# Altium schematic sheet Sheet1.SchDoc: Volume_LED_indicator
size A3; Author: Sergiy_83
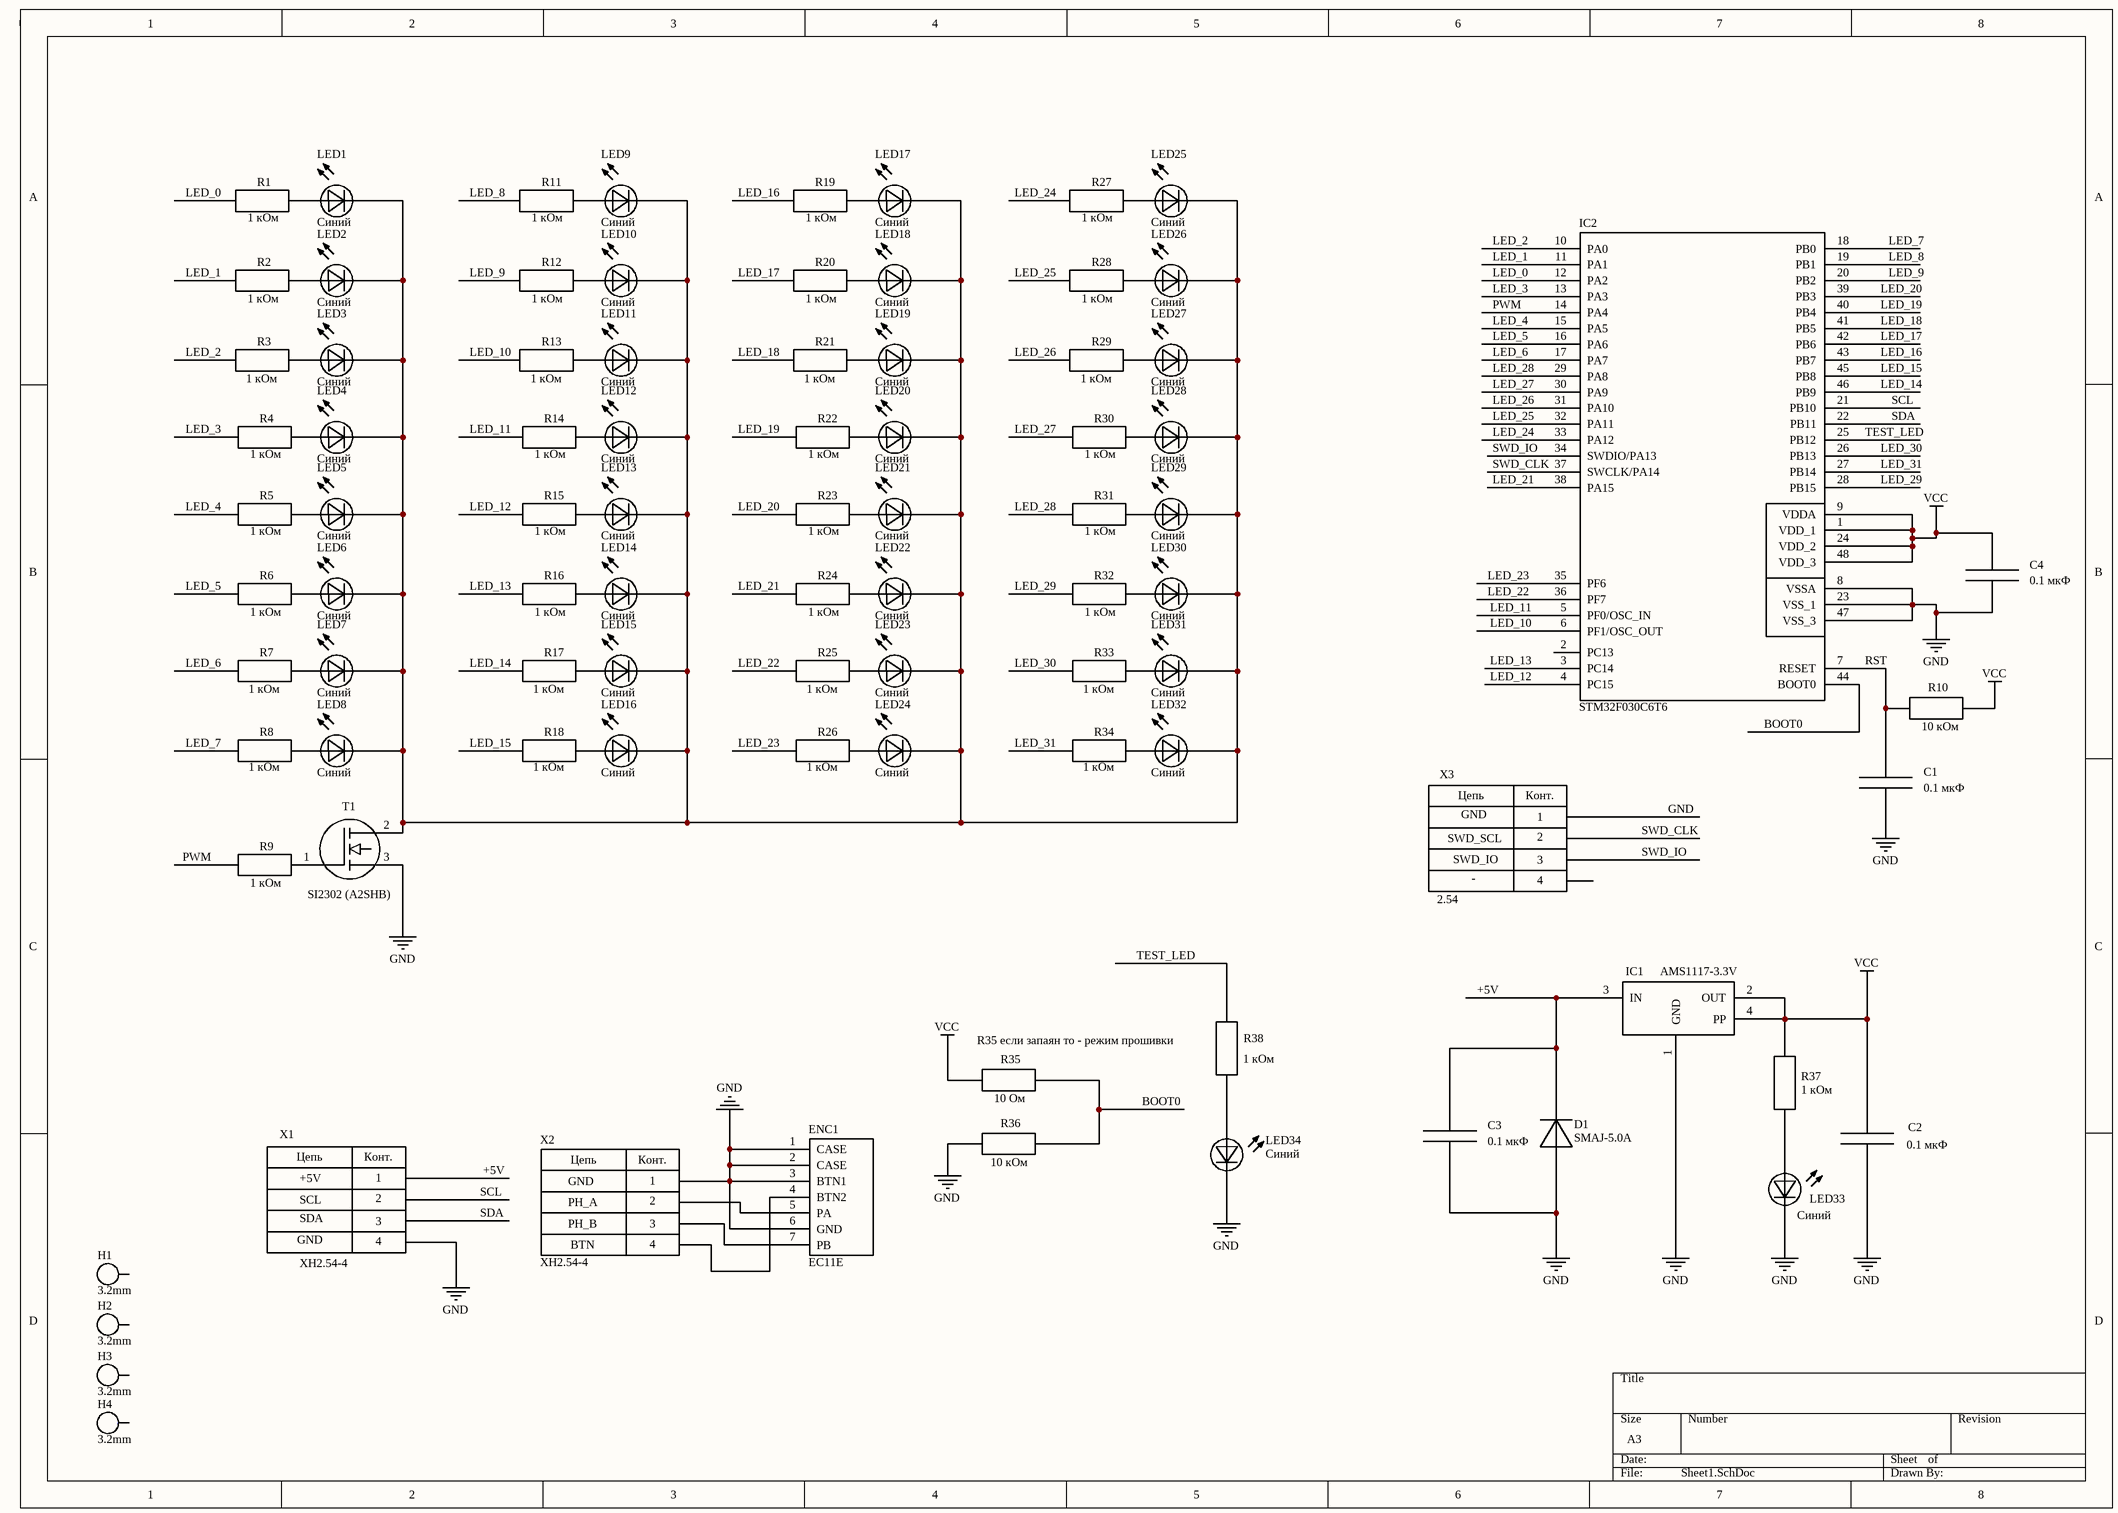
[diagram p0: Sheet1.SchDoc]

## Parts
C1  0.1 мкФ  [Конденсатор SMD Case 0805]
C2  0.1 мкФ  [Конденсатор SMD Case 1206]
C3  0.1 мкФ  [Конденсатор SMD Case 0805]
C4  0.1 мкФ  [Конденсатор SMD Case 0805]
D1  SMAJ-5.0A  [Диод SS14]
ENC1  EC11E  [Encoder]
H1  3.2mm  [Отверстие 3,2]
H2  3.2mm  [Отверстие 3,2]
H3  3.2mm  [Отверстие 3,2]
H4  3.2mm  [Отверстие 3,2]
IC1  AMS1117-3.3V  [SOT-223]
IC2  STM32F030С6T6  [TQFP-48]
LED1  Синий  [Светодиод  3x2 mm]
LED2  Синий  [Светодиод  3x2 mm]
LED3  Синий  [Светодиод  3x2 mm]
LED4  Синий  [Светодиод  3x2 mm]
LED5  Синий  [Светодиод  3x2 mm]
LED6  Синий  [Светодиод  3x2 mm]
LED7  Синий  [Светодиод  3x2 mm]
LED8  Синий  [Светодиод  3x2 mm]
LED9  Синий  [Светодиод  3x2 mm]
LED10  Синий  [Светодиод  3x2 mm]
LED11  Синий  [Светодиод  3x2 mm]
LED12  Синий  [Светодиод  3x2 mm]
LED13  Синий  [Светодиод  3x2 mm]
LED14  Синий  [Светодиод  3x2 mm]
LED15  Синий  [Светодиод  3x2 mm]
LED16  Синий  [Светодиод  3x2 mm]
LED17  Синий  [Светодиод  3x2 mm]
LED18  Синий  [Светодиод  3x2 mm]
LED19  Синий  [Светодиод  3x2 mm]
LED20  Синий  [Светодиод  3x2 mm]
LED21  Синий  [Светодиод  3x2 mm]
LED22  Синий  [Светодиод  3x2 mm]
LED23  Синий  [Светодиод  3x2 mm]
LED24  Синий  [Светодиод  3x2 mm]
LED25  Синий  [Светодиод  3x2 mm]
LED26  Синий  [Светодиод  3x2 mm]
LED27  Синий  [Светодиод  3x2 mm]
LED28  Синий  [Светодиод  3x2 mm]
LED29  Синий  [Светодиод  3x2 mm]
LED30  Синий  [Светодиод  3x2 mm]
LED31  Синий  [Светодиод  3x2 mm]
LED32  Синий  [Светодиод  3x2 mm]
LED33  Синий  [SMD 1206 Светодиод ВАЙТ]
LED34  Синий  [SMD 1206 Светодиод ВАЙТ]
R1  1 кОм  [SMD 0805 Резистор]
R2  1 кОм  [SMD 0805 Резистор]
R3  1 кОм  [SMD 0805 Резистор]
R4  1 кОм  [SMD 0805 Резистор]
R5  1 кОм  [SMD 0805 Резистор]
R6  1 кОм  [SMD 0805 Резистор]
R7  1 кОм  [SMD 0805 Резистор]
R8  1 кОм  [SMD 0805 Резистор]
R9  1 кОм  [SMD 0805 Резистор]
R10  10 кОм  [SMD 0805 Резистор]
R11  1 кОм  [SMD 0805 Резистор]
R12  1 кОм  [SMD 0805 Резистор]
R13  1 кОм  [SMD 0805 Резистор]
R14  1 кОм  [SMD 0805 Резистор]
R15  1 кОм  [SMD 0805 Резистор]
R16  1 кОм  [SMD 0805 Резистор]
R17  1 кОм  [SMD 0805 Резистор]
R18  1 кОм  [SMD 0805 Резистор]
R19  1 кОм  [SMD 0805 Резистор]
R20  1 кОм  [SMD 0805 Резистор]
R21  1 кОм  [SMD 0805 Резистор]
R22  1 кОм  [SMD 0805 Резистор]
R23  1 кОм  [SMD 0805 Резистор]
R24  1 кОм  [SMD 0805 Резистор]
R25  1 кОм  [SMD 0805 Резистор]
R26  1 кОм  [SMD 0805 Резистор]
R27  1 кОм  [SMD 0805 Резистор]
R28  1 кОм  [SMD 0805 Резистор]
R29  1 кОм  [SMD 0805 Резистор]
R30  1 кОм  [SMD 0805 Резистор]
R31  1 кОм  [SMD 0805 Резистор]
R32  1 кОм  [SMD 0805 Резистор]
R33  1 кОм  [SMD 0805 Резистор]
R34  1 кОм  [SMD 0805 Резистор]
R35  10 Ом  [SMD 0805 Резистор]
R36  10 кОм  [SMD 0805 Резистор]
R37  1 кОм  [SMD 0805 Резистор]
R38  1 кОм  [SMD 0805 Резистор]
T1  SI2302 (A2SHB)  [SMD SOT-23 Транзистор 3 pin]
X1  XH2.54-4  [(1x4) PIN XH 2.54 HEADR]
X2  XH2.54-4  [(1x4) PIN XH 2.54 HEADR]
X3  2.54  [(1x4)PIN 2.54 HEADR]

## Nets
GND: C1.2(-) C2.2(-) C3.2(-) C4.2(-) D1.1(А) ENC1.1(CASE) ENC1.2(CASE) ENC1.3(BTN1) ENC1.6(GND) IC1.1(GND) IC2.8(VSSA) IC2.23(VSS_1) IC2.47(VSS_3) LED33.2(K) LED34.2(K) R36.1(left) T1.3 X1.4 X2.1 X3.1
VCC: C2.1(+) C4.1(+) IC1.2(OUT) IC1.4(PP) IC2.1(VDD_1) IC2.9(VDDA) IC2.24(VDD_2) IC2.48(VDD_3) R10.2(right) R35.1(left) R37.2(right)
+5V: C3.1(+) D1.2(K) IC1.3(IN) X1.1
BOOT0: IC2.44(BOOT0) R35.2(right) R36.2(right)
LED_0: IC2.12(PA2) R1.1(left)
LED_1: IC2.11(PA1) R2.1(left)
LED_2: IC2.10(PA0) R3.1(left)
LED_3: IC2.13(PA3) R4.1(left)
LED_4: IC2.15(PA5) R5.1(left)
LED_5: IC2.16(PA6) R6.1(left)
LED_6: IC2.17(PA7) R7.1(left)
LED_7: IC2.18(PB0) R8.1(left)
LED_8: IC2.19(PB1) R11.1(left)
LED_9: IC2.20(PB2) R12.1(left)
LED_10: IC2.6(PF1/OSC_OUT) R13.1(left)
LED_11: IC2.5(PF0/OSC_IN) R14.1(left)
LED_12: IC2.4(PC15) R15.1(left)
LED_13: IC2.3(PC14) R16.1(left)
LED_14: IC2.46(PB9) R17.1(left)
LED_15: IC2.45(PB8) R18.1(left)
LED_16: IC2.43(PB7) R19.1(left)
LED_17: IC2.42(PB6) R20.1(left)
LED_18: IC2.41(PB5) R21.1(left)
LED_19: IC2.40(PB4) R22.1(left)
LED_20: IC2.39(PB3) R23.1(left)
LED_21: IC2.38(PA15) R24.1(left)
LED_22: IC2.36(PF7) R25.1(left)
LED_23: IC2.35(PF6) R26.1(left)
LED_24: IC2.33(PA12) R27.1(left)
LED_25: IC2.32(PA11) R28.1(left)
LED_26: IC2.31(PA10) R29.1(left)
LED_27: IC2.30(PA9) R30.1(left)
LED_28: IC2.29(PA8) R31.1(left)
LED_29: IC2.28(PB15) R32.1(left)
LED_30: IC2.26(PB13) R33.1(left)
LED_31: IC2.27(PB14) R34.1(left)
PWM: IC2.14(PA4) R9.1(left)
RST: C1.1(+) IC2.7(RESET) R10.1(left)
SCL: IC2.21(PB10) X1.2
SDA: IC2.22(PB11) X1.3
SWD_CLK: IC2.37(SWCLK/PA14) X3.2
SWD_IO: IC2.34(SWDIO/PA13) X3.3
TEST_LED: IC2.25(PB12) R38.2(right)
NetENC1_4: ENC1.4(BTN2) X2.4
NetENC1_5: ENC1.5(PA) X2.2
NetENC1_7: ENC1.7(PB) X2.3
NetLED1_1: LED1.1(А) R1.2(right)
NetLED1_2: LED1.2(K) LED2.2(K) LED3.2(K) LED4.2(K) LED5.2(K) LED6.2(K) LED7.2(K) LED8.2(K) LED9.2(K) LED10.2(K) LED11.2(K) LED12.2(K) LED13.2(K) LED14.2(K) LED15.2(K) LED16.2(K) LED17.2(K) LED18.2(K) LED19.2(K) LED20.2(K) LED21.2(K) LED22.2(K) LED23.2(K) LED24.2(K) LED25.2(K) LED26.2(K) LED27.2(K) LED28.2(K) LED29.2(K) LED30.2(K) LED31.2(K) LED32.2(K) T1.2
NetLED2_1: LED2.1(А) R2.2(right)
NetLED3_1: LED3.1(А) R3.2(right)
NetLED4_1: LED4.1(А) R4.2(right)
NetLED5_1: LED5.1(А) R5.2(right)
NetLED6_1: LED6.1(А) R6.2(right)
NetLED7_1: LED7.1(А) R7.2(right)
NetLED8_1: LED8.1(А) R8.2(right)
NetLED9_1: LED9.1(А) R11.2(right)
NetLED10_1: LED10.1(А) R12.2(right)
NetLED11_1: LED11.1(А) R13.2(right)
NetLED12_1: LED12.1(А) R14.2(right)
NetLED13_1: LED13.1(А) R15.2(right)
NetLED14_1: LED14.1(А) R16.2(right)
NetLED15_1: LED15.1(А) R17.2(right)
NetLED16_1: LED16.1(А) R18.2(right)
NetLED17_1: LED17.1(А) R19.2(right)
NetLED18_1: LED18.1(А) R20.2(right)
NetLED19_1: LED19.1(А) R21.2(right)
NetLED20_1: LED20.1(А) R22.2(right)
NetLED21_1: LED21.1(А) R23.2(right)
NetLED22_1: LED22.1(А) R24.2(right)
NetLED23_1: LED23.1(А) R25.2(right)
NetLED24_1: LED24.1(А) R26.2(right)
NetLED25_1: LED25.1(А) R27.2(right)
NetLED26_1: LED26.1(А) R28.2(right)
NetLED27_1: LED27.1(А) R29.2(right)
NetLED28_1: LED28.1(А) R30.2(right)
NetLED29_1: LED29.1(А) R31.2(right)
NetLED30_1: LED30.1(А) R32.2(right)
NetLED31_1: LED31.1(А) R33.2(right)
NetLED32_1: LED32.1(А) R34.2(right)
NetLED33_1: LED33.1(А) R37.1(left)
NetLED34_1: LED34.1(А) R38.1(left)
NetR9_2: R9.2(right) T1.1

Not connected (* = marked no-connect by the designer): H1 1; H2 1; H3 1; H4 1; IC2 2(PC13); X3 4

## Notes on the sheet
- SWD_SCL
- GND
- SWD_IO
- -
- R35 если запаян то - режим прошивки
- +5V
- SCL
- SDA
- PH_A
- PH_B
- BTN
- (in symbol (1x4) pin XH 2.54 Header) Цепь; Конт.

## Library data of the parts
C1-C4 = Конденсатор: Value: 0.1 мкФ
  C1 C3 C4: Case: SMD 0805
  C2: Case: SMD 1206
D1 = Диод: Value: SMAJ-5.0A; Case: DO-214AC
ENC1 = Encoder_01: Value: EC11E; Case: -
H1-H4 = Отверстие монтажное: Value: 3.2mm; Case: Отверстие
IC1 = AMS1117: Value: AMS1117-3.3V; Case: SOT-223
IC2 = STM32F030: Value: STM32F030С6T6; Case: *
LED1-LED34 = Светодиод: Value: Синий
  LED1-LED32: Case: 3x2x4
  LED33 LED34: Case: SMD 1206
R1-R38 = Резистор: Case: SMD 0805
  R1-R9 R11-R34 R37 R38: Value: 1 кОм
  R10 R36: Value: 10 кОм
  R35: Value: 10 Ом
T1 = Транзистор MOSFET N-конал (как n-p-n): Value: SI2302 (A2SHB); Case: SOT-23
X1-X3 = (1x4) pin XH 2.54 Header
  X1 X2: Value: XH2.54-4; Case: XH2.54-4
  X3: Value: 2.54